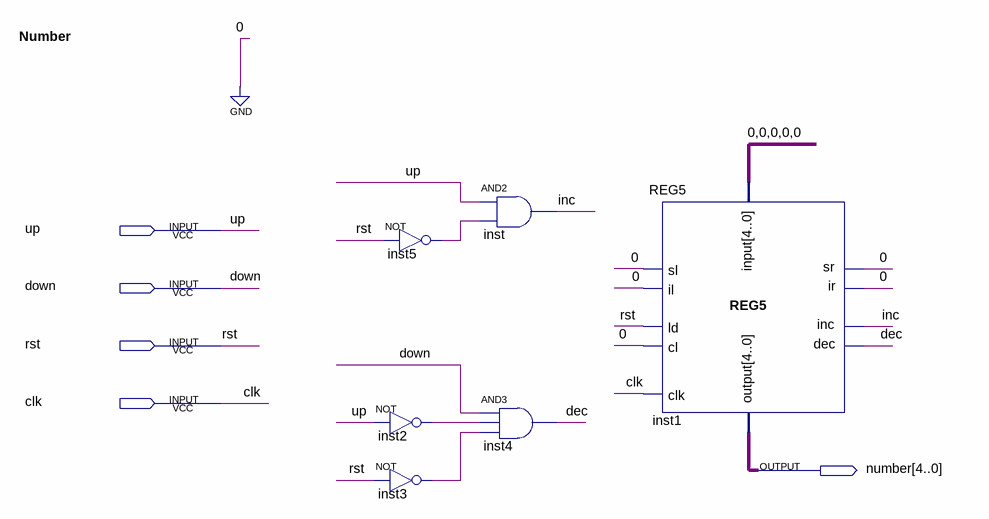
[diagram p0: schematic sheet]
// Quartus schematic Number.bdf as structural Verilog: 6 symbols, 5 pins
module Number (
  input  up,
  input  down,
  input  rst,
  input  clk,
  output [4:0] number
);

  wire dec, inc, inst2_out, inst3_out, inst5_out;

  not inst5 (inst5_out, rst);
  not inst2 (inst2_out, up);
  not inst3 (inst3_out, rst);
  and inst (inc, up, inst5_out);
  and inst4 (dec, down, inst2_out, inst3_out);
  REG5 inst1 (
    .clk(clk), .ld(rst), .\input ({5{1'b0}}), .sr(1'b0), .ir(1'b0), .sl(1'b0), .il(1'b0), .inc(inc),
    .dec(dec), .cl(1'b0), .\output (number));

  // Notes on the sheet:
  //   Number
endmodule
